# EAGLE design dsky_md_3.0v (EAGLE 6.5.0)
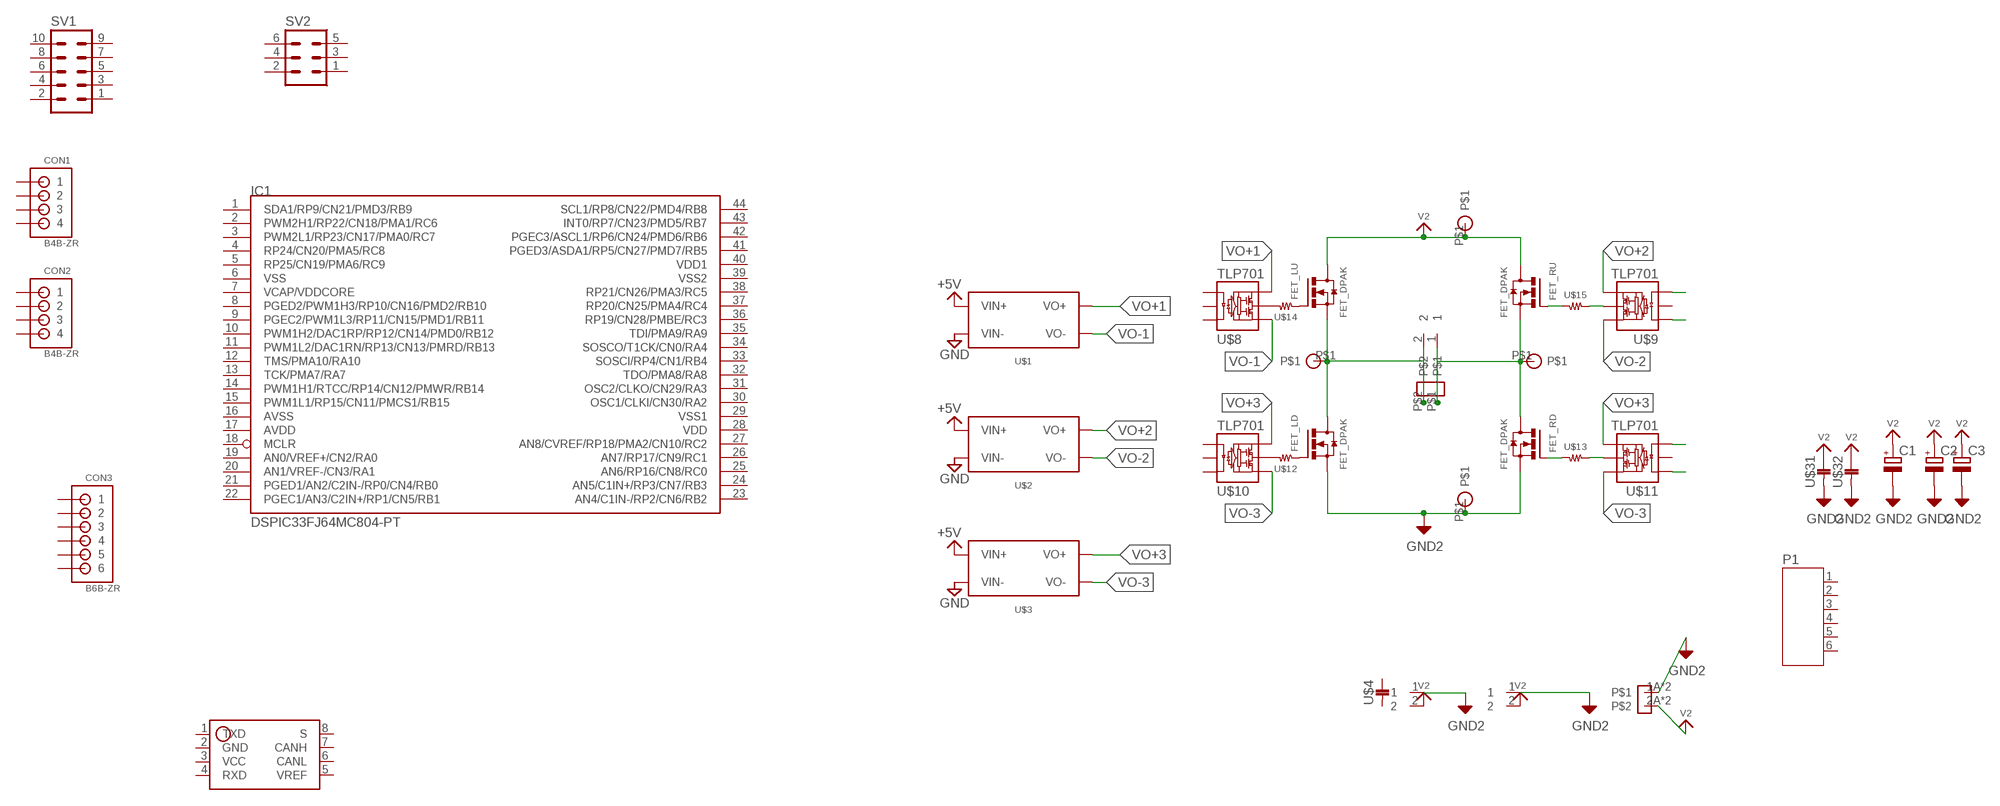
[diagram p0: schematic, sheet 1]

## Parts
C1  CPOL-EUE3.5-8  [E3,5-8]
C2  CPOL-EUE3.5-8  [E3,5-8]
C3  CPOL-EU150CLZ-1010  [150CLZ-1010]
CON1  B4B-ZR  [B4B-ZR]
CON2  B4B-ZR  [B4B-ZR]
CON3  B6B-ZR  [B6B-ZR]
FET_LD  FET_DPAK  [DPAK]
FET_LU  FET_DPAK  [DPAK]
FET_RD  FET_DPAK  [DPAK]
FET_RU  FET_DPAK  [DPAK]
IC1  DSPIC33FJ64MC804-PT  [TQFP44]
P1  JST-PH6  [JST-PH6]
SV1  ML10  [ML10]
SV2  ML6  [ML6]
U$1  MAU100  [MAU]
U$2  MAU100  [MAU]
U$3  MAU100  [MAU]
U$4  1608  [1608]
U$5  VL_2  [VL_2]
U$8  TLP701  [11-5J1]
U$9  TLP701  [11-5J1]
U$10  TLP701  [11-5J1]
U$11  TLP701  [11-5J1]
U$12  RESISTOR__SMD  [1608]
U$13  RESISTOR__SMD  [1608]
U$14  RESISTOR__SMD  [1608]
U$15  RESISTOR__SMD  [1608]
U$16  VL_2  [VL_2]
U$21  HAN_FAST  [HOLE_4.4MM]
U$22  HAN_FAST  [HOLE_4.4MM]
U$23  VL_2  [VL_2]
U$24  TERMINAL_2P  [TERMINAL_2P]
U$31  3225  [3225]
U$32  3225  [3225]
U$43  HAN_FAST  [HOLE_4.4MM]
U$44  HAN_FAST  [HOLE_4.4MM]
U$45  SN65HVD1050  [SOIC8]
U$46  ML_300_2P  [ML_300_2P]

## Nets
+5V: U$1.P$1(VIN+) U$2.P$1(VIN+) U$3.P$1(VIN+)
GND: U$1.P$2(VIN-) U$2.P$2(VIN-) U$3.P$2(VIN-)
GND2 [30v]: C1.- C2.- C3.- FET_LD.3(S) FET_RD.3(S) U$5.1 U$16.1 U$31.P$2 U$32.P$2 U$43.P$1 U$46.1A U$46.1B
M1 [30v]: FET_LD.2(D) FET_LU.3(S) U$21.P$1 U$23.2 U$24.P$2
M2 [30v]: FET_RD.2(D) FET_RU.3(S) U$22.P$1 U$23.1 U$24.P$1
N$1: U$10.5(OUT) U$12.2
N$2: FET_LU.1(G) U$14.1
N$3: FET_LD.1(G) U$12.1
N$4: FET_RD.1(G) U$13.1
N$5: U$11.5(OUT) U$13.2
N$6: U$8.5(OUT) U$14.2
N$7: FET_RU.1(G) U$15.1
N$8: U$9.5(OUT) U$15.2
N$9: U$9.1(LED+)
N$10: U$9.3(LED-)
N$11: U$11.1(LED+)
N$12: U$11.3(LED-)
V2 [30v]: C1.+ C2.+ C3.+ FET_LU.2(D) FET_RU.2(D) U$5.2 U$16.2 U$31.P$1 U$32.P$1 U$44.P$1 U$46.2A U$46.2B
VO+1: U$1.P$5(VO+) U$8.6(VCC)
VO+2: U$2.P$5(VO+) U$9.6(VCC)
VO+3: U$3.P$5(VO+) U$10.6(VCC) U$11.6(VCC)
VO-1: U$1.P$3(VO-) U$8.4(GND)
VO-2: U$2.P$3(VO-) U$9.4(GND)
VO-3: U$3.P$3(VO-) U$10.4(GND) U$11.4(GND)
Unconnected: CON1.1 CON1.2 CON1.3 CON1.4 CON2.1 CON2.2 CON2.3 CON2.4 CON3.1 CON3.2 CON3.3 CON3.4 CON3.5 CON3.6 IC1.1(SDA1/RP9/CN21/PMD3/RB9) IC1.2(PWM2H1/RP22/CN18/PMA1/RC6) IC1.3(PWM2L1/RP23/CN17/PMA0/RC7) IC1.4(RP24/CN20/PMA5/RC8) IC1.5(RP25/CN19/PMA6/RC9) IC1.7(VCAP/VDDCORE) IC1.8(PGED2/PWM1H3/RP10/CN16/PMD2/RB10) IC1.9(PGEC2/PWM1L3/RP11/CN15/PMD1/RB11) IC1.10(PWM1H2/DAC1RP/RP12/CN14/PMD0/RB12) IC1.11(PWM1L2/DAC1RN/RP13/CN13/PMRD/RB13) IC1.12(TMS/PMA10/RA10) IC1.13(TCK/PMA7/RA7) IC1.14(PWM1H1/RTCC/RP14/CN12/PMWR/RB14) IC1.15(PWM1L1/RP15/CN11/PMCS1/RB15) IC1.18(MCLR) IC1.19(AN0/VREF+/CN2/RA0) IC1.20(AN1/VREF-/CN3/RA1) IC1.21(PGED1/AN2/C2IN-/RP0/CN4/RB0) IC1.22(PGEC1/AN3/C2IN+/RP1/CN5/RB1) IC1.23(AN4/C1IN-/RP2/CN6/RB2) IC1.24(AN5/C1IN+/RP3/CN7/RB3) IC1.25(AN6/RP16/CN8/RC0) IC1.26(AN7/RP17/CN9/RC1) IC1.27(AN8/CVREF/RP18/PMA2/CN10/RC2) IC1.30(OSC1/CLKI/CN30/RA2) IC1.31(OSC2/CLKO/CN29/RA3) IC1.32(TDO/PMA8/RA8) IC1.33(SOSCI/RP4/CN1/RB4) IC1.34(SOSCO/T1CK/CN0/RA4) IC1.35(TDI/PMA9/RA9) IC1.36(RP19/CN28/PMBE/RC3) IC1.37(RP20/CN25/PMA4/RC4) IC1.38(RP21/CN26/PMA3/RC5) IC1.41(PGED3/ASDA1/RP5/CN27/PMD7/RB5) IC1.42(PGEC3/ASCL1/RP6/CN24/PMD6/RB6) IC1.43(INT0/RP7/CN23/PMD5/RB7) IC1.44(SCL1/RP8/CN22/PMD4/RB8) P1.1 P1.2 P1.3 P1.4 P1.5 P1.6 SV1.1 SV1.2 SV1.3 SV1.4 SV1.5 SV1.6 SV1.7 SV1.8 SV1.9 SV1.10 SV2.1 SV2.2 SV2.3 SV2.4 SV2.5 SV2.6 U$4.P$1 U$4.P$2 U$8.1(LED+) U$8.2(NC1) U$8.3(LED-) U$9.2(NC1) U$10.1(LED+) U$10.2(NC1) U$10.3(LED-) U$11.2(NC1) U$45.1(TXD) U$45.2(GND) U$45.3(VCC) U$45.4(RXD) U$45.5(VREF) U$45.6(CANL) U$45.7(CANH) U$45.8(S)

## Power pins joined to a net without a drawn wire
AVDD: IC1.17(AVDD)
AVSS: IC1.16(AVSS)
VDD: IC1.28(VDD)
VDD1: IC1.40(VDD1)
VSS: IC1.6(VSS)
VSS1: IC1.29(VSS1)
VSS2: IC1.39(VSS2)

## Library data of the parts
C1-C3 = rcl:CPOL-EU: POLARIZED CAPACITOR, European symbol
CON1 CON2 = jst:B4B-ZR: JST-ZH Connector 4 pol, 1.5mm pitch Package: B4B-ZR Source: http://www.jst-mfg.com/product/pdf/eng/eZH.pdf
CON3 = jst:B6B-ZR: JST-ZH Connector 6 pol, 1.5mm pitch Package: B6B-ZR Source: http://www.jst-mfg.com/product/pdf/eng/eZH.pdf
FET_LD FET_LU FET_RD FET_RU = 06_FET:FET_DPAK
IC1 = microchip-dspic33fjxxmc:DSPIC33FJ64MC804: dsPIC33FJ32MC302/304, dsPIC33FJ64MCX02/X04, AND dsPIC33FJ128MCX02/X04 High-Performance, 16-bit Digital Signal Controllers Package:44 Pin TQFP Operating Range: * Up to 40 MIPS operation (at 3.0V -3.6V): - Industrial temperature range (-40°C to +85°C) - Extended temperature range (-40°C to +125°C) High-Performance DSC CPU: * Modified Harvard architecture * C compiler optimized instruction set * 16-bit wide data path * 24-bit wide instructions * Linear program memory addressing up to 4M instruction words * Linear data memory addressing up to 64 Kbytes * 83 base instructions: mostly 1 word/1 cycle * Two 40-bit accumulators with rounding and saturation options * Flexible and powerful addressing modes: - Indirect - Modulo - Bit-Reversed * Software stack * 16 x 16 fractional/integer multiply operations * 32/16 and 16/16 divide operations * Single-cycle multiply and accumulate: - Accumulator write back for DSP operations - Dual data fetch * Up to ±16-bit shifts for up to 40-bit data Direct Memory Access (DMA): * 8-channel hardware DMA * Up to 2 Kbytes dual ported DMA buffer area (DMA RAM) to store data transferred via DMA: - Allows data transfer between RAM and a peripheral while CPU is executing code (no cycle stealing) * Most peripherals support DMA Timers/Capture/Compare/PWM: * Timer/Counters, up to five 16-bit timers: - Can pair up to make two 32-bit timers - One timer runs as a Real-Time Clock with an external 32.768 kHz oscillator - Programmable prescaler * Input Capture (up to four channels): - Capture on up, down or both edges - 16-bit capture input functions - 4-deep FIFO on each capture * Output Compare (up to four channels): - Single or Dual 16-bit Compare mode - 16-bit Glitchless PWM mode * Hardware Real-Time Clock/Calendar (RTCC): - Provides clock, calendar, and alarm functions Interrupt Controller: * 5-cycle latency * Up to 53 available interrupt sources * Up to three external interrupts * Seven programmable priority levels * Five processor exceptions Digital I/O: * Peripheral pin Select functionality * Up to 35 programmable digital I/O pins * Wake-up/Interrupt-on-Change for up to 31 pins * Output pins can drive from 3.0V to 3.6V * Up to 5V output with open drain configuration * All digital input pins are 5V tolerant * 4 mA sink on all I/O pins On-Chip Flash and SRAM: * Flash program memory (up to 128 Kbytes) * Data SRAM (up to 16 Kbytes) * Boot, Secure, and General Security for program Flash System Management: * Flexible clock options: - External, crystal, resonator, internal RC - Fully integrated Phase-Locked Loop (PLL) - Extremely low jitter PLL * Power-up Timer * Oscillator Start-up Timer/Stabilizer * Watchdog Timer with its own RC oscillator * Fail-Safe Clock Monitor * Reset by multiple sources Power Management: * On-chip 2.5V voltage regulator * Switch between clock sources in real time * Idle, Sleep, and Doze modes with fast wake-up Analog-to-Digital Converters (ADCs): * 10-bit, 1.1 Msps or 12-bit, 500 Ksps conversion: - Two and four simultaneous samples (10-bit ADC) - Up to nine input channels with auto-scanning - Conversion start can be manual or synchronized with one of four trigger sources - Conversion possible in Sleep mode - ±2 LSb max integral nonlinearity - ±1 LSb max differential nonlinearity Audio Digital-to-Analog Converter (DAC): - 16-bit Dual Channel DAC module - 100 Ksps maximum sampling rate - Second-Order Digital Delta-Sigma Modulator Comparator Module: * Two analog comparators with programmable input/output configuration CMOS Flash Technology: * Low-power, high-speed Flash technology * Fully static design * 3.3V (±10%) operating voltage * Industrial and Extended temperature * Low power consumption Motor Control Peripherals: * 6-channel 16-bit Motor Control PWM: - Three duty cycle generators - Independent or Complementary mode - Programmable dead-time and output polarity - Edge-aligned or center-aligned - Manual output override control - One Fault input - Trigger for ADC conversions - PWM frequency for 16-bit resolution (@ 40 MIPS) = 1220 Hz for Edge-Aligned mode, 610 Hz for Center-Aligned mode - PWM frequency for 11-bit resolution (@ 40 MIPS) = 39.1 kHz for Edge-Aligned mode, 19.55 kHz for Center-Aligned mode * 2-channel 16-bit Motor Control PWM: - One duty cycle generator - Independent or Complementary mode - Programmable dead time and output polarity - Edge-aligned or center-aligned - Manual output override control - One Fault input - Trigger for ADC conversions - PWM frequency for 16-bit resolution (@ 40 MIPS) = 1220 Hz for Edge-Aligned mode, 610 Hz for Center-Aligned mode - PWM frequency for 11-bit resolution (@ 40 MIPS) = 39.1 kHz for Edge-Aligned mode, 19.55 kHz for Center-Aligned mode * 2-Quadrature Encoder Interface module: - Phase A, Phase B, and index pulse input - 16-bit up/down position counter - Count direction status - Position Measurement (x2 and x4) mode - Programmable digital noise filters on inputs - Alternate 16-bit Timer/Counter mode - Interrupt on position counter rollover/underflow
P1 = jst-ph:JST-PH6
SV1 = con-ml:ML10: HARTING; OC_FARNELL: unknown; OC_NEWARK: unknown
SV2 = con-ml:ML6: HARTING; OC_FARNELL: unknown; OC_NEWARK: unknown
U$1-U$3 = 04_IC:MAU100
U$4 = 02_C:1608
U$5 U$16 U$23 = 08_CONECTOR:VL_2
U$8-U$11 = 04_IC:TLP701
U$12-U$15 = 01_R:RESISTOR__SMD
U$21 U$22 U$43 U$44 = 08_CONECTOR:HAN_FAST
U$24 = 08_CONECTOR:TERMINAL_2P
U$31 U$32 = 02_C:3225
U$45 = 04_IC:SN65HVD1050
U$46 = 08_CONECTOR:ML_300_2P

## Net classes
1 30v: clearance 0.8 mm

## Board
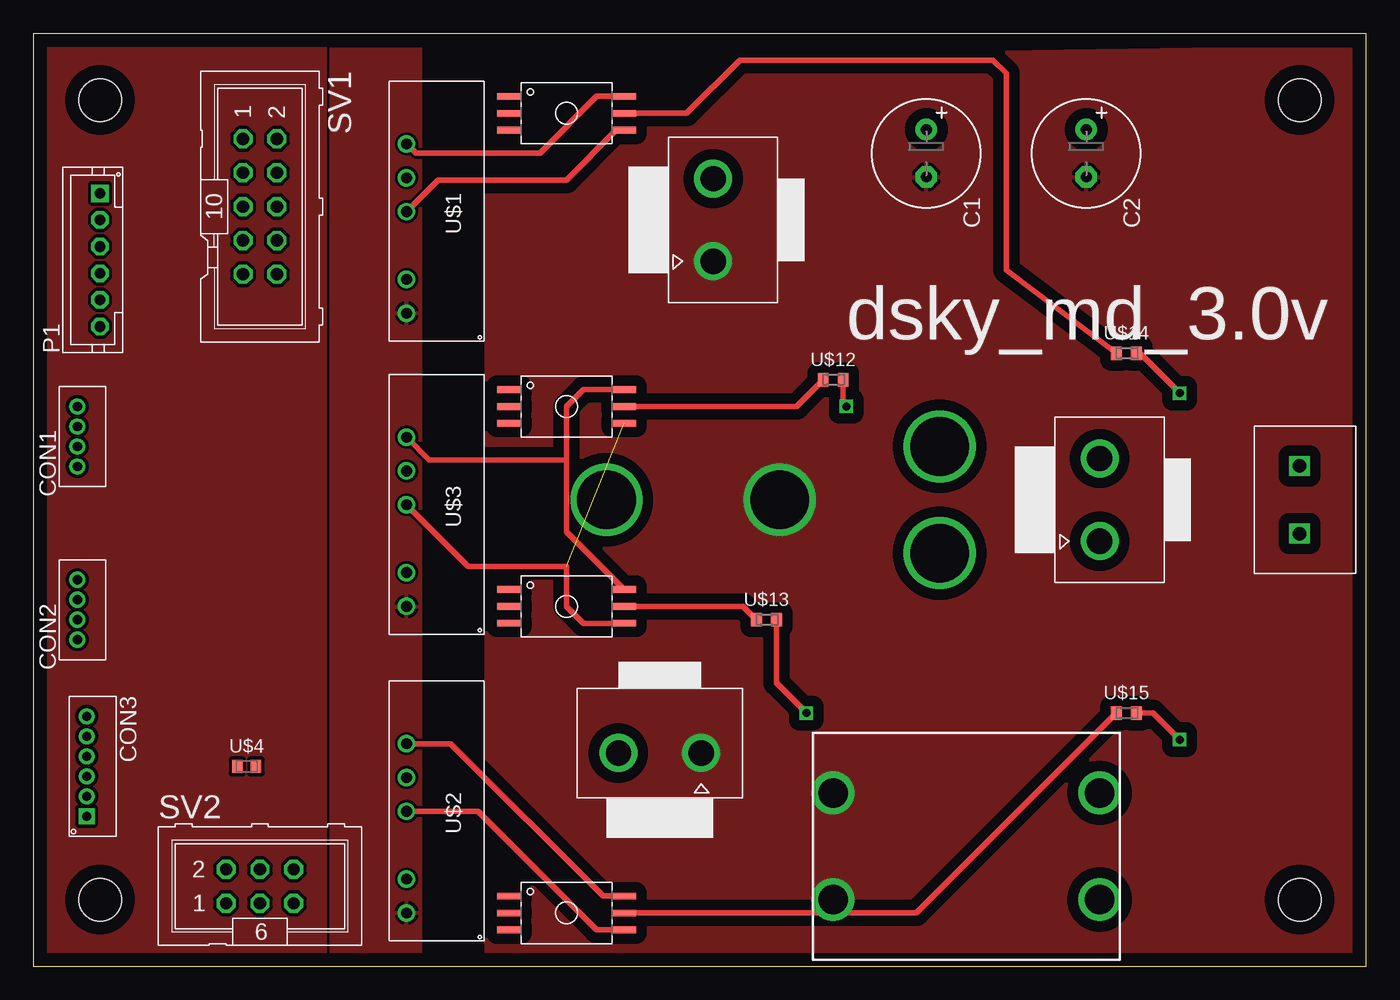
[diagram p1: board, top side]
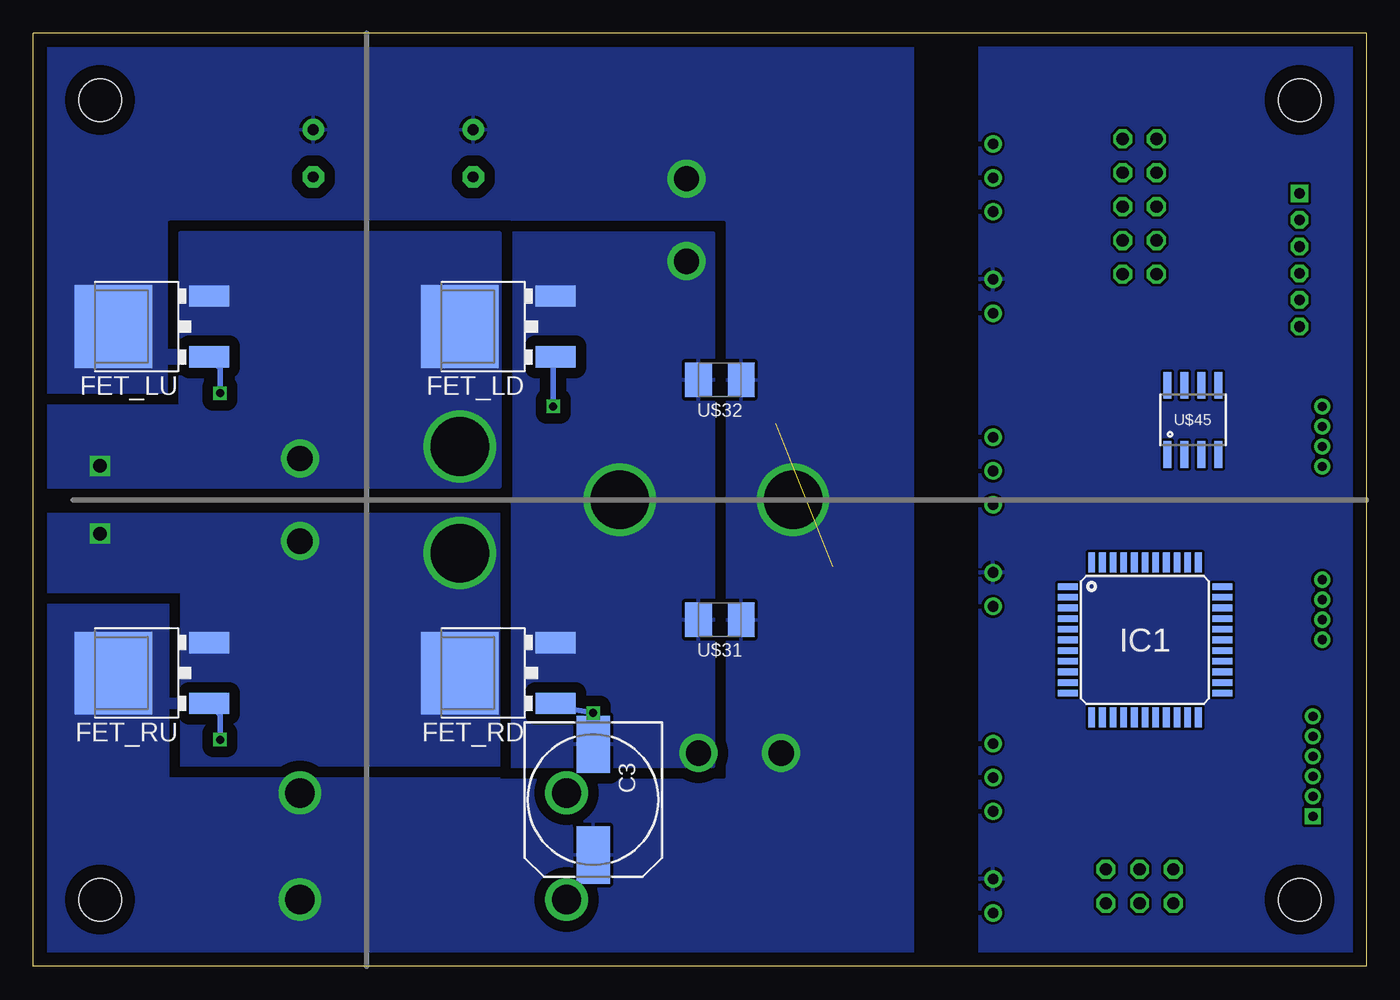
[diagram p2: board, bottom side, seen from below]

Size 100 x 70 mm. Coordinates in mm from the lower left corner, seen from the top.
Outline: 0,0 100,0 100,70 0,70 0,0
Copper layers (1*16): Top 0.035mm / dielectric 1.5mm / Bottom 0.035mm
Design rules "default *": minimum track width 0mil, minimum drill 24mil, track to track 8mil, track to pad 8mil, pad to pad 8mil, via to via 8mil, smd to smd 8mil, copper to edge 40mil, drill to drill 8mil, minimum pad ring 10mil, minimum via ring 8mil, stop-mask expansion 4mil, vias tented up to drill 0mil, thermal gap 10mil
Holes 3.2 mm at 95,65 95,5 5,5 5,65

### Footprints (pad centres in the part's own frame; a part is rotated, then mirrored left to right if it is on the bottom)
E3,5-8 = drill 0.813 pad 1.6: + -1.778,0 | drill 0.813 pad 1.6 octagon: - 1.778,0
150CLZ-1010 = smd 4.3 x 2.5: + 4.15,0; - -4.15,0
B4B-ZR = drill 0.7: 1 6,-1.3; 2 4.5,-1.3; 3 3,-1.3; 4 1.5,-1.3
B6B-ZR = drill 0.7 square: 1 3.75,0 | drill 0.7: 2 2.25,0; 3 0.75,0; 4 -0.75,0; 5 -2.25,0; 6 -3.75,0
DPAK = smd 1.6 x 3: 1 -2.286,-7.18; 3 2.286,-7.18 | smd 6.2 x 5.8: 2 0,0
TQFP44 = smd 1.5 x 0.5: 1 -5.8,4; 2 -5.8,3.2; 3 -5.8,2.4; 4 -5.8,1.6; 5 -5.8,0.8; 6 -5.8,0; 7 -5.8,-0.8; 8 -5.8,-1.6; 9 -5.8,-2.4; 10 -5.8,-3.2; 11 -5.8,-4; 23 5.8,-4; 24 5.8,-3.2; 25 5.8,-2.4; 26 5.8,-1.6; 27 5.8,-0.8; 28 5.8,0; 29 5.8,0.8; 30 5.8,1.6; 31 5.8,2.4; 32 5.8,3.2; 33 5.8,4 | smd 0.5 x 1.5: 12 -4,-5.8; 13 -3.2,-5.8; 14 -2.4,-5.8; 15 -1.6,-5.8; 16 -0.8,-5.8; 17 0,-5.8; 18 0.8,-5.8; 19 1.6,-5.8; 20 2.4,-5.8; 21 3.2,-5.8; 22 4,-5.8; 34 4,5.8; 35 3.2,5.8; 36 2.4,5.8; 37 1.6,5.8; 38 0.8,5.8; 39 0,5.8; 40 -0.8,5.8; 41 -1.6,5.8; 42 -2.4,5.8; 43 -3.2,5.8; 44 -4,5.8
JST-PH6 = drill 0.8 square: 1 5,0 | drill 0.8 octagon: 2 3,0; 3 1,0; 4 -1,0; 5 -3,0; 6 -5,0
ML10 = drill 0.914 octagon: 1 -5.08,-1.27; 2 -5.08,1.27; 3 -2.54,-1.27; 4 -2.54,1.27; 5 0,-1.27; 6 0,1.27; 7 2.54,-1.27; 8 2.54,1.27; 9 5.08,-1.27; 10 5.08,1.27
ML6 = drill 0.914 octagon: 1 -2.54,-1.27; 2 -2.54,1.27; 3 0,-1.27; 4 0,1.27; 5 2.54,-1.27; 6 2.54,1.27
MAU = drill 0.8: P$1 0,0; P$2 2.54,0; P$3 7.62,0; P$4 10.16,0; P$5 12.7,0
1608 = smd 0.8 x 1: P$1 -0.7,0; P$2 0.7,0
VL_2 = drill 1.9: 1 0,3.1; 2 0,-3.1
11-5J1 = smd 0.5 x 1.8: 1 -1.27,-4.3; 2 0,-4.3; 3 1.27,-4.3; 4 1.27,4.3; 5 0,4.3; 6 -1.27,4.3
1608' = smd 0.8 x 1: 1 -0.75,0; 2 0.75,0
HOLE_4.4MM = drill 4.4: P$1 0,0
TERMINAL_2P = drill 1 square: P$1 0,2.54; P$2 0,-2.54
3225 = smd 2 x 2.6: P$1 -1.6,0; P$2 1.6,0
SOIC8 = smd 0.6 x 2: 1 -1.905,-2.6; 2 -0.635,-2.6; 3 0.635,-2.6; 4 1.905,-2.6; 5 1.905,2.6; 6 0.635,2.6; 7 -0.635,2.6; 8 -1.905,2.6
ML_300_2P = drill 2.2: 1A -10,4; 1B -10,-4; 2A 10,4; 2B 10,-4

### Placement (x,y rotation side)
C1  67,61 270 top
C2  79,61 270 top
C3  58,12.5 270 bottom
CON1  2,36 90 top
CON2  2,23 90 top
CON3  4,15 270 top
FET_LD  68,48 90 bottom
FET_LU  94,48 90 bottom
FET_RD  68,22 90 bottom
FET_RU  94,22 90 bottom
IC1  16.6,24.48 0 bottom
P1  5,53 90 top
SV1  17,57 270 top
SV2  17,6 0 top
U$1  28,49 90 top
U$2  28,4 90 top
U$3  28,27 90 top
U$4  16,15 0 top
U$5  47,16 270 top
U$8  40,64 270 top
U$9  40,4 270 top
U$10  40,42 270 top
U$11  40,27 270 top
U$12  [1608']  60,44 180 top
U$13  [1608']  55,26 180 top
U$14  [1608']  82,46 180 top
U$15  [1608']  82,19 180 top
U$16  51,56 180 top
U$21  68,39 0 top
U$22  68,31 0 top
U$23  80,35 180 top
U$24  95,35 180 top
U$31  48.5,26 180 bottom
U$32  48.5,44 180 bottom
U$43  56,35 0 top
U$44  43,35 0 top
U$45  13,41 0 bottom
U$46  70,9 0 top

### Tracks (layer width: path | path; a pad name or v marks a point on that pad's centre or on a via)
+3.3V
  pour Top (isolate 0.254, rank 2): 0,70 22,70 22,0 0,0
+5V
  pour Top (rank 3): 22,69 29,69 29,1 22,1
GND
  pour Bottom: 0,70 29,70 29,0 0,0
GND2
  pour Bottom (rank 3): 65,55 49,55 49,15 65,15
  pour Top: 34,68 99,69 99,1 34,0
M1
  pour Bottom (rank 2): 65,55 89,55 89,42 99,42 99,36 65,36
M2
  pour Bottom: 65,34 99,34 99,28 89,28 89,15 65,15
N$1
  Top 0.4: U$12.2 57.25,42 U$10.5
N$2  (via drill 0.6)
  Top 0.4: v86,43 83,46 U$14.1
  Bottom 0.4: FET_LU.1 86,44.89 v86,43
N$3  (via drill 0.6)
  Top 0.4: v61,42 60.75,42.25 U$12.1
  Bottom 0.4: FET_LD.1 61,45.53 v61,42
N$4  (via drill 0.6)
  Top 0.4: v58,19 55.75,21.25 U$13.1
  Bottom 0.4: FET_RD.1 61,19.53 v58,19
N$5
  Top 0.4: U$13.2 53.25,27 U$11.5
N$6
  Top 0.4: U$14.2 73,52.25 73,67 72,68 53,68 49,64 U$8.5
N$7  (via drill 0.6)
  Top 0.4: v86,17 84,19 U$15.1
  Bottom 0.4: FET_RU.1 86,18.89 v86,17
N$8
  Top 0.4: U$15.2 66.25,4 U$9.5
V2
  pour Bottom (rank 4): 99,69 34,69 34,1 99,1
VO+1
  Top 0.4: U$1.P$5 28.7,61 38,61 42.27,65.27 U$8.6
VO+2
  Top 0.4: U$2.P$5 31.3,16.7 42.73,5.27 U$9.6
VO+3
  Top 0.4: U$3.P$5 29.7,38 40,38 | 40,38 40,42 41.27,43.27 U$10.6 | U$11.6 40,32.57 40,38
VO-1
  Top 0.4: U$1.P$3 30.38,59 40,59 43.73,62.73 U$8.4
VO-2
  Top 0.4: U$2.P$3 33.38,11.62 42.27,2.73 U$9.4
VO-3  (1 unrouted)
  Top 0.4: U$3.P$3 32.62,30 40,30 40,27 41.27,25.73 U$11.4

### Text on the board
tPlace: dsky_md_3.0v